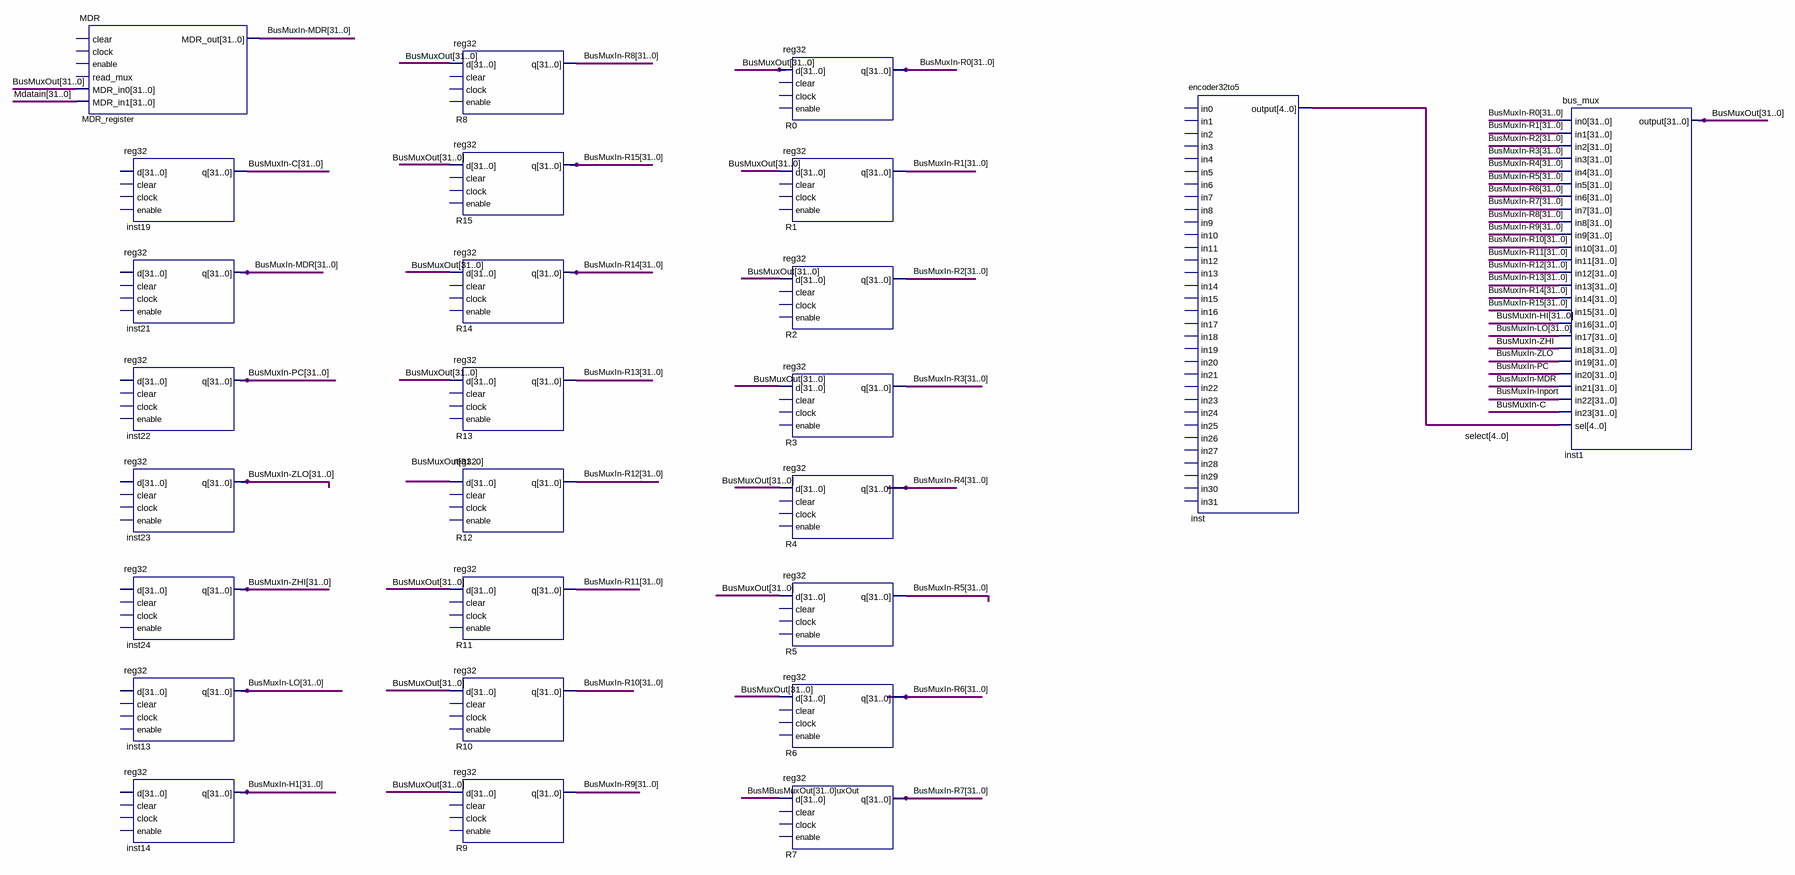
[diagram p0: schematic sheet]
// Quartus schematic bus.bdf as structural Verilog: 26 symbols, 0 pins
module bus (
);

  wire \BusMBusMuxOut[31..0]uxOut , \BusMuxIn-C_1bit , \BusMuxIn-Inport , \BusMuxIn-MDR_1bit ,
       \BusMuxIn-PC_1bit , \BusMuxIn-ZHI_1bit , \BusMuxIn-ZLO_1bit ;
  wire [4:0] select;
  wire [31:0] \BusMuxIn-C , \BusMuxIn-H1 , \BusMuxIn-HI , \BusMuxIn-LO , \BusMuxIn-MDR , \BusMuxIn-PC ,
       \BusMuxIn-R0 , \BusMuxIn-R1 , \BusMuxIn-R2 , \BusMuxIn-R3 , \BusMuxIn-R4 , \BusMuxIn-R5 ,
       \BusMuxIn-R6 , \BusMuxIn-R7 , \BusMuxIn-R8 , \BusMuxIn-R9 , \BusMuxIn-R10 , \BusMuxIn-R11 ,
       \BusMuxIn-R12 , \BusMuxIn-R13 , \BusMuxIn-R14 , \BusMuxIn-R15 , \BusMuxIn-ZHI , \BusMuxIn-ZLO ,
       BusMuxOut, Mdatain;

  MDR MDR_register (
    .MDR_in0(BusMuxOut), .MDR_in1(Mdatain), .MDR_out(\BusMuxIn-MDR ));  // open: clear, clock, enable, read_mux
  reg32 inst19 (.q(\BusMuxIn-C ));  // open: d, clear, clock, enable
  reg32 inst21 (.q(\BusMuxIn-MDR ));  // open: d, clear, clock, enable
  reg32 inst22 (.q(\BusMuxIn-PC ));  // open: d, clear, clock, enable
  reg32 inst23 (.q(\BusMuxIn-ZLO ));  // open: d, clear, clock, enable
  reg32 inst24 (.q(\BusMuxIn-ZHI ));  // open: d, clear, clock, enable
  reg32 inst13 (.q(\BusMuxIn-LO ));  // open: d, clear, clock, enable
  reg32 inst14 (.q(\BusMuxIn-H1 ));  // open: d, clear, clock, enable
  reg32 R8 (.d(BusMuxOut), .q(\BusMuxIn-R8 ));  // open: clear, clock, enable
  reg32 R15 (.d(BusMuxOut), .q(\BusMuxIn-R15 ));  // open: clear, clock, enable
  reg32 R14 (.d(BusMuxOut), .q(\BusMuxIn-R14 ));  // open: clear, clock, enable
  reg32 R13 (.d(BusMuxOut), .q(\BusMuxIn-R13 ));  // open: clear, clock, enable
  reg32 R12 (.d(BusMuxOut), .q(\BusMuxIn-R12 ));  // open: clear, clock, enable
  reg32 R11 (.d(BusMuxOut), .q(\BusMuxIn-R11 ));  // open: clear, clock, enable
  reg32 R10 (.d(BusMuxOut), .q(\BusMuxIn-R10 ));  // open: clear, clock, enable
  reg32 R9 (.d(BusMuxOut), .q(\BusMuxIn-R9 ));  // open: clear, clock, enable
  reg32 R0 (.d(BusMuxOut), .q(\BusMuxIn-R0 ));  // open: clear, clock, enable
  reg32 R1 (.d(BusMuxOut), .q(\BusMuxIn-R1 ));  // open: clear, clock, enable
  reg32 R2 (.d(BusMuxOut), .q(\BusMuxIn-R2 ));  // open: clear, clock, enable
  reg32 R3 (.d(BusMuxOut), .q(\BusMuxIn-R3 ));  // open: clear, clock, enable
  reg32 R4 (.d(BusMuxOut), .q(\BusMuxIn-R4 ));  // open: clear, clock, enable
  reg32 R5 (.d(BusMuxOut), .q(\BusMuxIn-R5 ));  // open: clear, clock, enable
  reg32 R6 (.d(BusMuxOut), .q(\BusMuxIn-R6 ));  // open: clear, clock, enable
  reg32 R7 (.d({32{\BusMBusMuxOut[31..0]uxOut }}), .q(\BusMuxIn-R7 ));  // open: clear, clock, enable
  encoder32to5 inst (.\output (select));  // open: in0, in1, in2, in3, in4, in5, in6, in7, in8, in9, in10, in11, in12, in13, in14, in15, in16, in17, in18, in19, in20, in21, in22, in23, in24, in25, in26, in27, in28, in29, in30, in31
  bus_mux inst1 (
    .in0(\BusMuxIn-R0 ), .in1(\BusMuxIn-R1 ), .in2(\BusMuxIn-R2 ), .in3(\BusMuxIn-R3 ), .in4(\BusMuxIn-R4 ),
    .in5(\BusMuxIn-R5 ), .in6(\BusMuxIn-R6 ), .in7(\BusMuxIn-R7 ), .in8(\BusMuxIn-R8 ), .in9(\BusMuxIn-R9 ),
    .in10(\BusMuxIn-R10 ), .in11(\BusMuxIn-R11 ), .in12(\BusMuxIn-R12 ), .in13(\BusMuxIn-R13 ),
    .in14(\BusMuxIn-R14 ), .in15(\BusMuxIn-R15 ), .in16(\BusMuxIn-HI ), .in17(\BusMuxIn-LO ),
    .in18({32{\BusMuxIn-ZHI_1bit }}), .in19({32{\BusMuxIn-ZLO_1bit }}), .in20({32{\BusMuxIn-PC_1bit }}),
    .in21({32{\BusMuxIn-MDR_1bit }}), .in22({32{\BusMuxIn-Inport }}), .in23({32{\BusMuxIn-C_1bit }}),
    .sel(select), .\output (BusMuxOut));
endmodule
